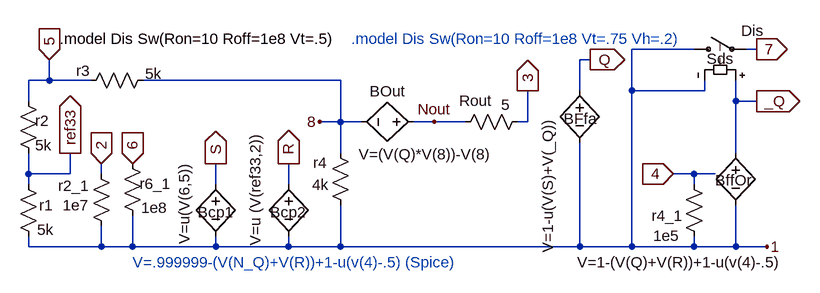
[diagram p0: schematic Neo555.asc]
Neo555.asc, the LTspice schematic file:
Version 4
SHEET 1 1356 916
WIRE 544 320 448 320
WIRE 640 320 624 320
WIRE 384 336 368 336
WIRE -448 368 -448 336
WIRE -448 368 -480 368
WIRE -384 368 -448 368
WIRE 0 368 -304 368
WIRE 368 384 368 336
WIRE 448 384 448 320
WIRE 560 384 560 368
WIRE 560 384 448 384
WIRE -480 400 -480 368
WIRE 608 400 608 368
WIRE 640 400 608 400
WIRE 0 432 0 368
WIRE 0 432 -32 432
WIRE 32 432 0 432
WIRE 144 432 112 432
WIRE 192 432 144 432
WIRE 288 432 288 384
WIRE 288 432 272 432
WIRE 0 480 0 432
WIRE 608 480 608 400
WIRE -480 512 -480 480
WIRE -416 512 -416 480
WIRE -416 512 -480 512
WIRE -368 512 -368 496
WIRE 544 512 512 512
WIRE 576 512 544 512
WIRE -480 528 -480 512
WIRE -192 528 -192 496
WIRE -80 528 -80 496
WIRE 544 528 544 512
WIRE -480 624 -480 608
WIRE -368 624 -368 592
WIRE -368 624 -480 624
WIRE -320 624 -320 576
WIRE -320 624 -368 624
WIRE -192 624 -192 608
WIRE -192 624 -320 624
WIRE -80 624 -80 608
WIRE -80 624 -192 624
WIRE 0 624 0 560
WIRE 0 624 -80 624
WIRE 368 624 368 464
WIRE 368 624 0 624
WIRE 448 624 448 384
WIRE 448 624 368 624
WIRE 544 624 544 608
WIRE 544 624 448 624
WIRE 608 624 608 560
WIRE 608 624 544 624
WIRE 656 624 608 624
FLAG -416 480 ref33
IOPIN -416 480 Out
FLAG -448 336 5
IOPIN -448 336 In
FLAG 640 320 7
IOPIN 640 320 Out
FLAG -32 432 8
FLAG 288 384 3
IOPIN 288 384 Out
FLAG 656 624 1
FLAG 512 512 4
IOPIN 512 512 In
FLAG -320 496 6
IOPIN -320 496 In
FLAG -192 496 S
IOPIN -192 496 Out
FLAG -368 496 2
IOPIN -368 496 In
FLAG -80 496 R
IOPIN -80 496 Out
FLAG 384 336 Q
IOPIN 384 336 Out
FLAG 640 400 _Q
IOPIN 640 400 Out
FLAG 144 432 Nout
SYMBOL res -496 512 R0
WINDOW 0 32 48 Left 2
WINDOW 3 29 86 Left 2
SYMATTR InstName r1
SYMATTR Value 5k
SYMBOL res -496 384 R0
WINDOW 0 26 46 Left 2
WINDOW 3 26 84 Left 2
SYMATTR InstName r2
SYMATTR Value 5k
SYMBOL res -400 384 R270
WINDOW 0 15 4 VTop 2
WINDOW 3 42 112 VBottom 2
SYMATTR InstName r3
SYMATTR Value 5k
SYMBOL sw 528 320 R270
WINDOW 0 -15 35 VRight 2
WINDOW 3 28 88 VRight 2
SYMATTR InstName Sds
SYMATTR Value Dis
SYMBOL res -16 464 R0
WINDOW 0 -26 31 Left 2
WINDOW 3 -28 65 Left 2
SYMATTR InstName r4
SYMATTR Value 4k
SYMBOL res -352 608 R180
WINDOW 0 34 78 Left 2
WINDOW 3 35 48 Left 2
SYMATTR InstName r2_1
SYMATTR Value 1e7
SYMBOL bv -192 512 R0
WINDOW 0 -28 59 Left 2
WINDOW 3 -48 109 VLeft 2
SYMATTR InstName Bcp1
SYMATTR Value V=u(V(6,5))
SYMBOL bv -80 512 R0
WINDOW 0 -28 59 Left 2
WINDOW 3 -51 -64 VRight 2
SYMATTR InstName Bcp2
SYMATTR Value V=u (V(ref33,2))
SYMBOL bv 368 368 R0
WINDOW 0 -25 59 Left 2
WINDOW 3 -49 57 VRight 2
SYMATTR InstName BFfa
SYMATTR Value V=1-u(V(S)+V(_Q))
SYMBOL res -336 480 R0
WINDOW 0 27 47 Left 2
WINDOW 3 29 84 Left 2
SYMATTR InstName r6_1
SYMATTR Value 1e8
SYMBOL bv 608 464 R0
WINDOW 0 -32 58 Left 2
WINDOW 3 -244 184 Left 2
SYMATTR InstName BffOr
SYMATTR Value V=1-(V(Q)+V(R))+1-u(v(4)-.5)
SYMBOL bv 128 432 R90
WINDOW 0 -32 56 VBottom 2
WINDOW 3 34 -3 VTop 2
SYMATTR InstName BOut
SYMATTR Value V=(V(Q)*V(8))-V(8)
SYMBOL res 288 416 R90
WINDOW 0 -1 80 VBottom 2
WINDOW 3 -26 34 VTop 2
SYMATTR InstName Rout
SYMATTR Value 5
SYMBOL res 528 512 R0
WINDOW 0 -49 64 Left 2
WINDOW 3 -47 95 Left 2
SYMATTR InstName r4_1
SYMATTR Value 1e5
TEXT -432 304 Left 2 !.model Dis Sw(Ron=10 Roff=1e8 Vt=.5)
TEXT -320 648 Left 2 ;V=.999999-(V(N_Q)+V(R))+1-u(v(4)-.5) (Spice)
TEXT 16 304 Left 2 ;.model Dis Sw(Ron=10 Roff=1e8 Vt=.75 Vh=.2)

The netlist it stands for:
* Neo555.asc
r1 ref33 1 5k
r2 5 ref33 5k
r3 5 8 5k
Sds 1 7 _Q 1 Dis
r4 8 1 4k
r2_1 1 2 1e7
Bcp1 S 1 V=u(V(6,5))
Bcp2 R 1 V=u (V(ref33,2))
BFfa Q 1 V=1-u(V(S)+V(_Q))
r6_1 6 1 1e8
BffOr _Q 1 V=1-(V(Q)+V(R))+1-u(v(4)-.5)
BOut Nout 8 V=(V(Q)*V(8))-V(8)
Rout 3 Nout 5
r4_1 4 1 1e5
.model Dis Sw(Ron=10 Roff=1e8 Vt=.5)
* V=.999999-(V(N_Q)+V(R))+1-u(v(4)-.5) (Spice)
* .model Dis Sw(Ron=10 Roff=1e8 Vt=.75 Vh=.2)
.backanno
.end